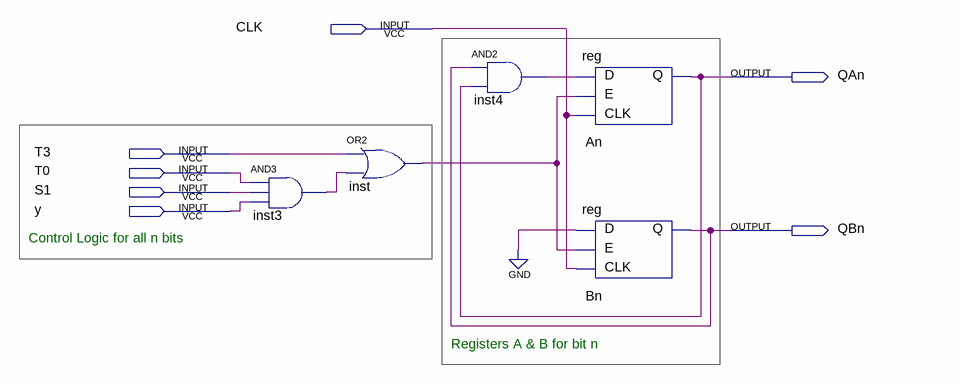
[diagram p0: schematic sheet]
// Quartus schematic hw12p4a.bdf as structural Verilog: 5 symbols, 7 pins
module hw12p4a (
  input  CLK,
  input  T3,
  input  T0,
  input  S1,
  input  y,
  output QAn,
  output QBn
);

  wire inst3_out, inst4_out, inst_out;

  and inst3 (inst3_out, T0, S1, y);
  or inst (inst_out, T3, inst3_out);
  and inst4 (inst4_out, QBn, QAn);
  \reg  An (.E(inst_out), .D(inst4_out), .CLK(CLK), .Q(QAn));
  \reg  Bn (.E(inst_out), .D(1'b0), .CLK(CLK), .Q(QBn));

  // Notes on the sheet:
  //   Control Logic for all n bits
  //   Registers A & B for bit n
endmodule
